# EAGLE design ai_esp12e_aerial (EAGLE 7.2.0)
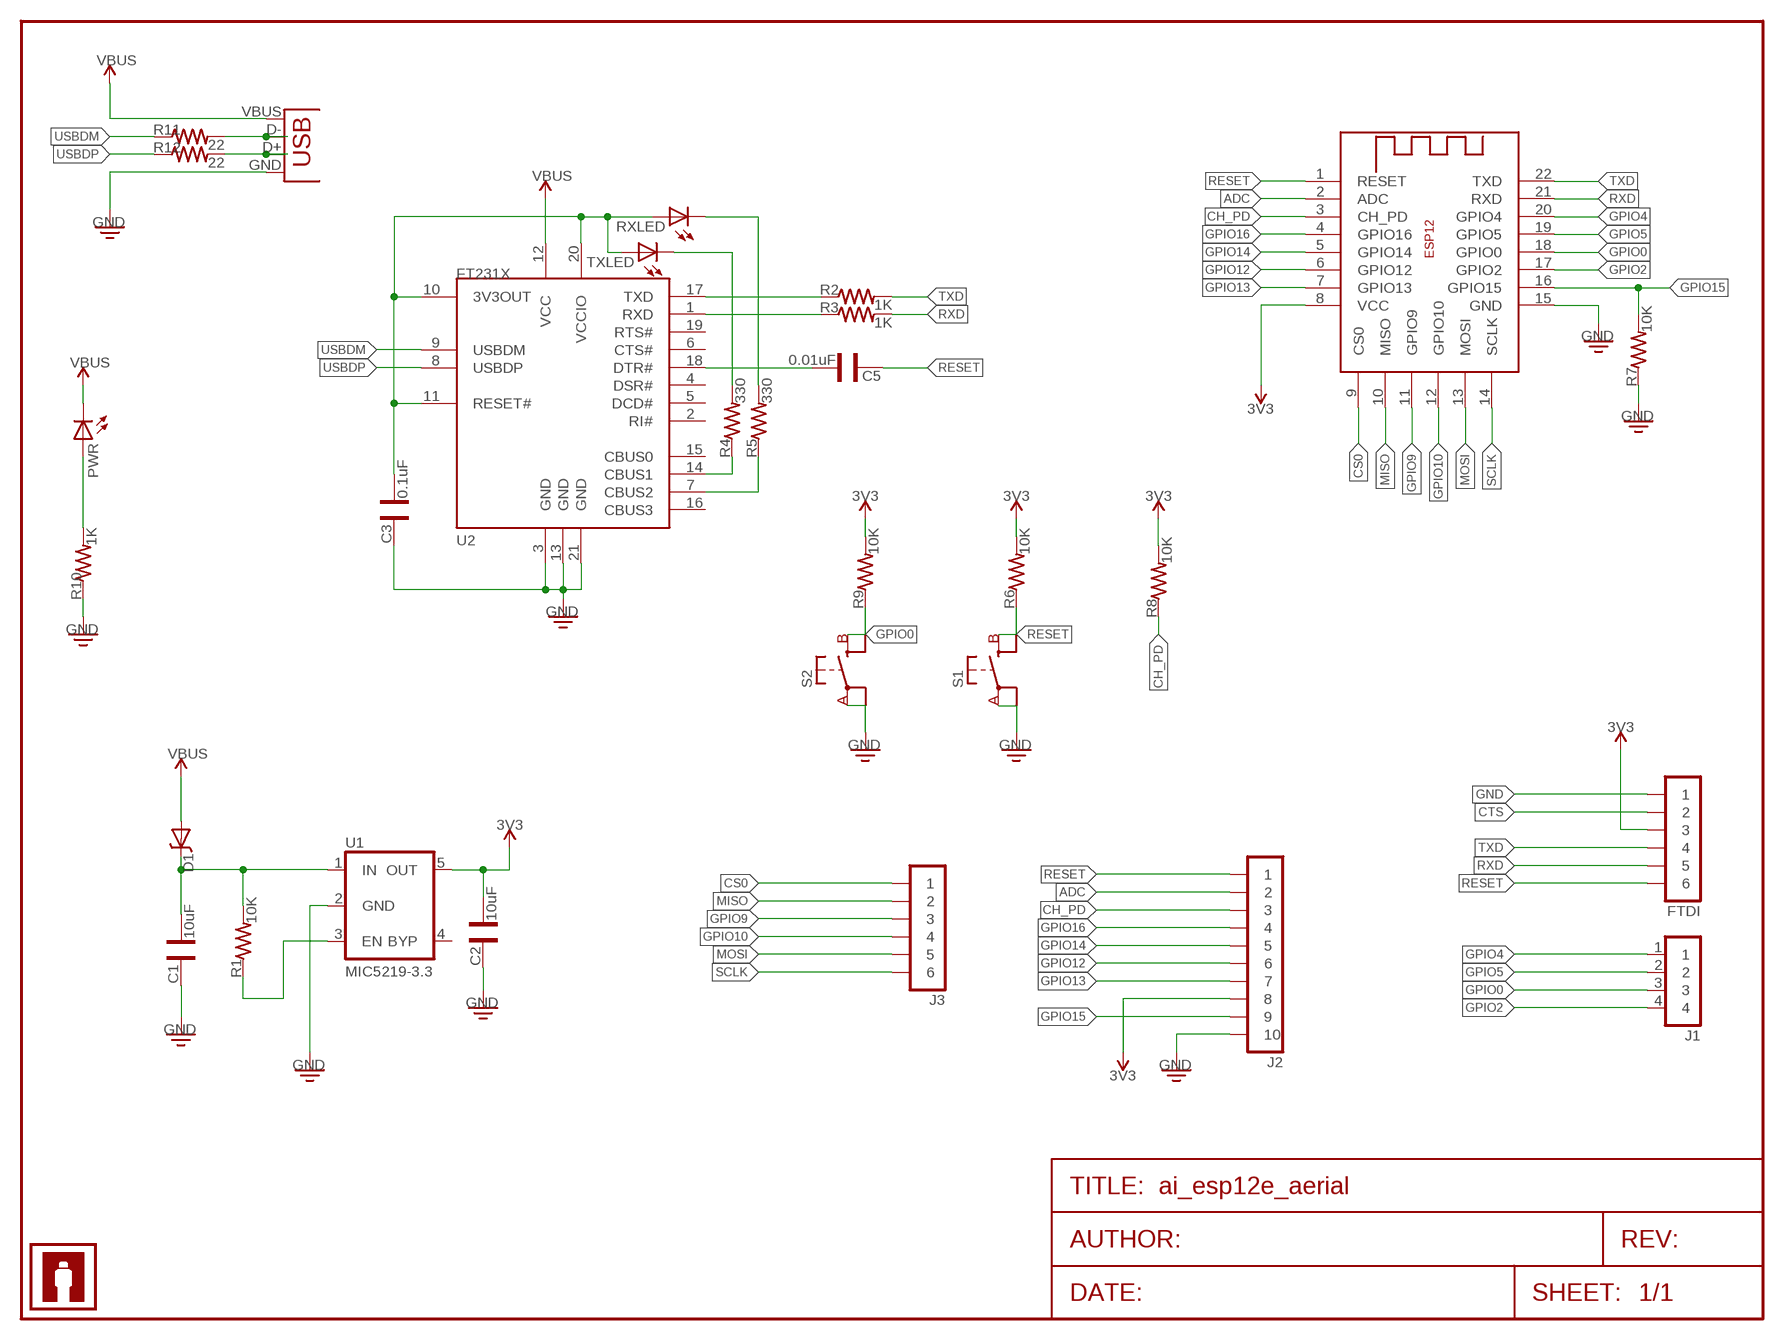
[diagram p0: schematic, sheet 1]
FRAME1 (FRAME-LETTER): AUTHOR: S. Parada

## Parts
C1  10uF  CAP0603  [CAP-0603]
C2  10uF  CAP0603  [CAP-0603]
C3  0.1uF  CAP0603  [CAP-0603]
C5  0.01uF  CAP0603  [CAP-0603]
D1  DIODE-SCHOTTKYSOD-523  [SOD-523]
FTDI  1X06FTDI  [1X06-CUSTOMSP]
J1  1X04NFNS  [1X04-NFNS]
J2  1X10NFNS  [1X10-NFNS]
J3  1X061X06-NFNS  [1X06-NFNS]
PWR  LED0603  [LED-0603]
R1  10K  RES0603  [RES-0603]
R2  1K  RES0603  [RES-0603]
R3  1K  RES0603  [RES-0603]
R4  330  RES0603  [RES-0603]
R5  330  RES0603  [RES-0603]
R6  10K  RES0603  [RES-0603]
R7  10K  RES0603  [RES-0603]
R8  10K  RES0603  [RES-0603]
R9  10K  RES0603  [RES-0603]
R10  1K  RES0603  [RES-0603]
R11  22  RES0603  [RES-0603]
R12  22  RES0603  [RES-0603]
RXLED  LED0603  [LED-0603]
S1  SW-SPSTSMD06X035  [SW-SPST-SMD06X-035]
S2  SW-SPSTSMD06X035  [SW-SPST-SMD06X-035]
TXLED  LED0603  [LED-0603]
U1  MIC5219-3.3  [SOT23-5]
U2  FT231X-Q  [QFN20]
U$1  AI-LOGOXS  [AI-LOGO-XS]
USB1  USBMICROB-TH  [USB-MICROB-TH]
X1  ESP-12  [ESP-12]

## Nets
3V3: C2.1 FTDI.3 J2.8 R6.2 R8.2 R9.2 U1.5(OUT) X1.8(VCC)
ADC: J2.2 X1.2(ADC)
CH_PD: J2.3 R8.1 X1.3(CH_PD)
CS0: J3.1 X1.9(CS0)
CTS: FTDI.2
GND: C1.2 C2.2 C3.2 FTDI.1 J2.10 R7.1 R10.1 S1.P$1(A) S2.P$1(A) U1.2(GND) U2.3(GND) U2.13(GND) U2.21(GND) USB1.GND X1.15(GND)
GPIO0: J1.3 R9.1 S2.P$2(B) X1.18(GPIO0)
GPIO2: J1.4 X1.17(GPIO2)
GPIO4: J1.1 X1.20(GPIO4)
GPIO5: J1.2 X1.19(GPIO5)
GPIO9: J3.3 X1.11(GPIO9)
GPIO10: J3.4 X1.12(GPIO10)
GPIO12: J2.6 X1.6(GPIO12)
GPIO13: J2.7 X1.7(GPIO13)
GPIO14: J2.5 X1.5(GPIO14)
GPIO15: J2.9 R7.2 X1.16(GPIO15)
GPIO16: J2.4 X1.4(GPIO16)
MISO: J3.2 X1.10(MISO)
MOSI: J3.5 X1.13(MOSI)
N$1: C1.1 D1.C R1.2 U1.1(IN)
N$3: R2.1 U2.17(TXD)
N$4: R1.1 U1.3(EN)
N$5: C3.1 RXLED.A TXLED.A U2.10(3V3OUT) U2.11(RESET#) U2.20(VCCIO)
N$6: R3.1 U2.1(RXD)
N$7: R4.2 TXLED.C
N$8: R5.1 U2.7(CBUS2)
N$9: R4.1 U2.14(CBUS1)
N$10: R5.2 RXLED.C
N$11: C5.1 U2.18(DTR#)
N$27: PWR.A R10.2
N$30: R11.2 USB1.D-
N$31: R12.2 USB1.D+
RESET: C5.2 FTDI.6 J2.1 R6.1 S1.P$2(B) X1.1(RESET)
RXD: FTDI.5 R3.2 X1.21(RXD)
SCLK: J3.6 X1.14(SCLK)
TXD: FTDI.4 R2.2 X1.22(TXD)
USBDM: R11.1 U2.9(USBDM)
USBDP: R12.1 U2.8(USBDP)
VBUS: D1.A PWR.C U2.12(VCC) USB1.VBUS
Unconnected: U1.4(BYP) U2.2(RI#) U2.4(DSR#) U2.5(DCD#) U2.6(CTS#) U2.15(CBUS0) U2.16(CBUS3) U2.19(RTS#)

## Library data of the parts
C1-C3 C5 = Ai_Passives:CAP
D1 = Ai_DiscreteSemis:DIODE-SCHOTTKY: Commonly MBRA140.
FTDI J3 = Ai_Connectors:1X06
J1 = Ai_Connectors:1X04
J2 = Ai_Connectors:1X10
PWR RXLED TXLED = Ai_LED:LED
R1-R12 = Ai_Passives:RES: Part # blah Digikey
S1 S2 = Ai_Electromechanical:SW-SPST
U1 = Ai_Power:MIC5219-*
U2 = Ai_IC:FT231X
U$1 = Ai_Miscellany:AI-LOGO
USB1 = Ai_Connectors:USB
X1 = Ai_IC:ESP-12

## Board
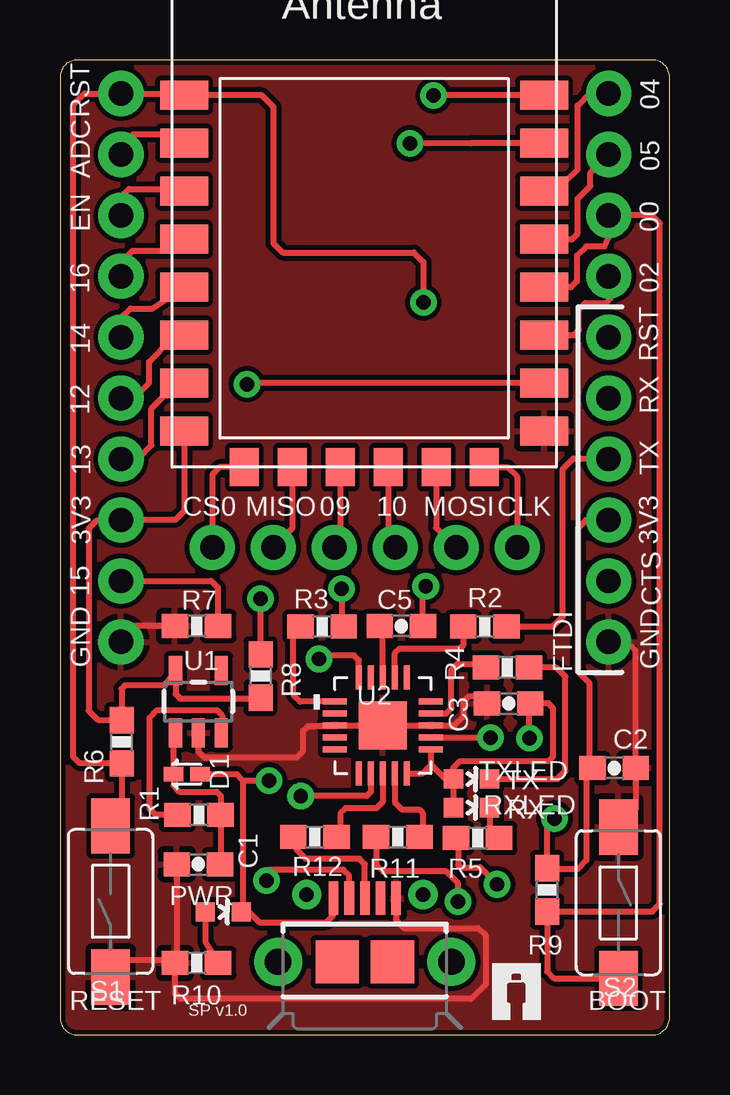
[diagram p1: board, top side]
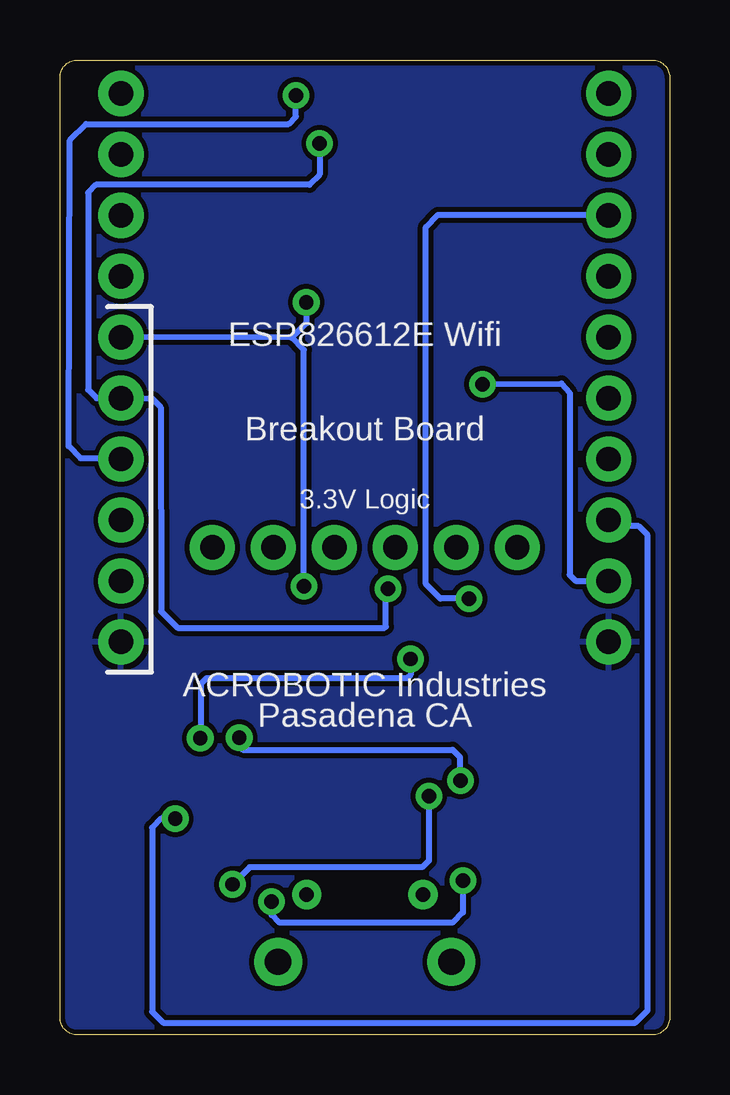
[diagram p2: board, bottom side, seen from below]

Size 25.4 x 40.64 mm. Coordinates in mm from the lower left corner, seen from the top.
Outline: 0,39.92 0,0.72 arc90 0.72,0 24.68,0 arc90 25.4,0.72 25.4,39.92 arc90 24.68,40.64 0.72,40.64 arc90 0,39.92
Copper layers (1*16): Top 0.035mm / dielectric 1.5mm / Bottom 0.035mm
Design rules "ai_2layer": minimum track width 7mil, minimum drill 15mil, track to track 8mil, track to pad 8mil, pad to pad 8mil, via to via 8mil, smd to smd 8mil, copper to edge 8mil, drill to drill 8mil, minimum pad ring 12mil, minimum via ring 10mil, stop-mask expansion 4mil, vias tented up to drill 20mil, thermal gap 10mil

### Footprints (pad centres in the part's own frame; a part is rotated, then mirrored left to right if it is on the bottom)
CAP-0603 = smd 1.1 x 1: 1 -0.9,0; 2 0.9,0
SOD-523 = smd 0.8 x 0.6: A -0.55,0; C 0.55,0
1X06-CUSTOMSP = drill 1.016 pad 1.88: 1 -6.35,0; 2 -3.81,0; 3 -1.27,0; 4 1.27,0; 5 3.81,0; 6 6.35,0
1X04-NFNS = drill 1.016 pad 1.88: 1 -3.81,0; 2 -1.27,0; 3 1.27,0; 4 3.81,0
1X10-NFNS = drill 1.016 pad 1.88: 1 -11.43,0; 2 -8.89,0; 3 -6.35,0; 4 -3.81,0; 5 -1.27,0; 6 1.27,0; 7 3.81,0; 8 6.35,0; 9 8.89,0; 10 11.43,0
1X06-NFNS = drill 1.016 pad 1.88: 1 -6.35,0; 2 -3.81,0; 3 -1.27,0; 4 1.27,0; 5 3.81,0; 6 6.35,0
LED-0603 = smd 0.8 x 0.8: A 0,-0.75; C 0,0.75
RES-0603 = smd 1.1 x 1: 1 -0.9,0; 2 0.9,0
SW-SPST-SMD06X-035 = smd 2.3 x 1.6: P$1 -3.15,0; P$2 3.15,0
SOT23-5 = smd 0.55 x 1.2: 1 -0.95,-1.3; 2 0,-1.3; 3 0.95,-1.3; 4 0.95,1.3; 5 -0.95,1.3
QFN20 = smd 1 x 0.25: 1 -2.032,0.968; 2 -2.032,0.468; 3 -2.032,-0.032; 4 -2.032,-0.532; 5 -2.032,-1.032; 11 1.968,-1.032; 12 1.968,-0.532; 13 1.968,-0.032; 14 1.968,0.468; 15 1.968,0.968 | smd 0.25 x 1: 6 -1.032,-2.032; 7 -0.532,-2.032; 8 -0.032,-2.032; 9 0.468,-2.032; 10 0.968,-2.032; 16 0.968,1.968; 17 0.468,1.968; 18 -0.032,1.968; 19 -0.532,1.968; 20 -1.032,1.968 | smd 2 x 2: 21 -0.032,-0.032
USB-MICROB-TH = smd 0.4 x 1.4: D+ 0,2.65; D- -0.65,2.65; GND 1.3,2.65; ID 0.65,2.65; VBUS -1.3,2.65 | smd 1.8 x 1.8: M5 -1.15,0; M6 1.15,0 | drill 0.6 pad 1.2: MT1 -2.425,2.8; MT2 2.425,2.8 | drill 1.1 pad 2: MT3 -3.61,0; MT4 3.61,0
ESP-12 = smd 2 x 1.2: 1 -7.5,4.5; 2 -7.5,2.5; 3 -7.5,0.5; 4 -7.5,-1.5; 5 -7.5,-3.5; 6 -7.5,-5.5; 7 -7.5,-7.5; 8 -7.5,-9.5; 15 7.5,-9.5; 16 7.5,-7.5; 17 7.5,-5.5; 18 7.5,-3.5; 19 7.5,-1.5; 20 7.5,0.5; 21 7.5,2.5; 22 7.5,4.5 | smd 1.2 x 1.6: 9 -5,-11; 10 -3,-11; 11 -1,-11; 12 1,-11; 13 3,-11; 14 5,-11

### Placement (x,y rotation side)
C1  5.77,7.11 180 top
C2  23.09,11.13 0 top
C3  18.69,13.82 180 top
C5  14.22,17.04 0 top
D1  5.28,10.87 180 top
FTDI  22.86,22.73 90 top
J1  22.86,35.43 270 top
J2  2.54,27.81 270 top
J3  12.7,20.32 0 top
PWR  6.81,5.13 270 top
R1  5.79,9.17 0 top
R2  17.7,17.02 0 top
R3  10.92,17.02 0 top
R4  18.64,15.32 0 top
R5  17.4,8.2 0 top
R6  2.57,12.22 90 top
R7  5.69,17.04 0 top
R8  8.36,14.96 270 top
R9  20.29,6.05 90 top
R10  5.69,3 0 top
R11  14.07,8.26 180 top
R12  10.62,8.26 180 top
RXLED  17.14,9.47 270 top
S1  2.11,5.56 90 top
S2  23.27,5.51 270 top
TXLED  17.14,10.67 270 top
U1  5.77,13.89 0 top
U2  13.49,12.93 0 top
U$1  18.03,0.64 0 top
USB1  12.7,3.05 0 top
X1  12.67,34.67 0 top

### Tracks (layer width: path | path; a pad name or v marks a point on that pad's centre or on a via)
3V3  (via drill 0.6)
  Top 0.254: FTDI.3 21.92,21.46 21.59,21.13 21.59,15.14 22.06,14.67 22.06,11.25 C2.1 21.95,11.09 21.95,7.29 21.57,6.91 20.33,6.91 R9.2 20.3,8.71 v20.6,9.02 | R8.2 8.24,14.02 5,14.02 4.82,14.21 U1.5 4.38,14.58 2.72,14.58 2.56,14.43 R6.2 2.55,13.13 1.57,13.13 1.19,13.51 1.19,21.11 1.52,21.44 J2.8 4.8,21.46 5.17,21.84 X1.8
  Bottom 0.254: v20.6,9.02 21.18,9.02 21.57,8.64 21.57,0.96 21.11,0.51 1.42,0.51 0.91,1.02 0.91,20.83 1.29,21.21 2.29,21.21 J2.8
ADC
  Top 0.254: J2.2 2.54,37.03 3.05,37.54 5.19,37.54 X1.2
CH_PD  (via drill 0.6)
  Top 0.254: J2.3 2.54,34.92 2.87,35.26 4.9,35.26 X1.3 | R8.1 v8.36,18.19
  Bottom 0.254: v8.36,18.19 9.55,18.19 10.16,18.8 10.16,33.68 9.65,34.19 2.56,34.19 J2.3
CS0
  Top 0.254: X1.9 6.65,23.67 6.35,23.37 J3.1
GND
  Top 0.254: U2.21 U2.3 11.44,12.88 10.34,12.88 10.13,12.68 10.13,11.84 9.86,11.56 6.02,11.56 5.77,11.81 U1.2 | U2.21 U2.13 16.43,12.9 16.82,13.28 16.82,13.89 17.04,14.12 17.72,14.12 C3.2 | C1.2 4.87,3.07 R10.1 | S1.P$1 2.11,2.59 2.64,3.12 4.66,3.12 R10.1 | U2.21 13.46,12.82 13.34,12.7 | 23.29,8.69 S2.P$1 23.99,9.38 C2.2 23.99,16.02 23.62,16.38 FTDI.1 | R7.1 3,17.04 2.82,16.87 2.82,16.66 J2.10 | USB1.GND 14,4.8 14.35,4.45 17.42,4.45 17.73,4.14 17.73,2.11 17.12,1.5 5.03,1.5 4.8,1.73 4.8,2.99 R10.1
  pour Top: 24.68,0 0.72,0 arc-90 0,0.72 0,39.92 arc-90 0.72,40.64 24.68,40.64 arc-90 25.4,39.92 25.4,0.72 arc-90
  pour Bottom: 0,39.92 0,0.72 arc90 0.72,0 24.68,0 arc90 25.4,0.72 25.4,39.92 arc90 24.68,40.64 0.72,40.64 arc90
GPIO0
  Top 0.254: X1.18 21.29,31.17 21.54,31.42 21.54,32.49 21.92,32.87 22.68,32.87 22.86,33.27 J1.3 24.66,34.16 24.99,33.83 24.99,5.46 24.68,5.14 R9.1 20.3,2.64 20.57,2.36 S2.P$2 | S2.P$2
GPIO2
  Top 0.254: X1.17 21.4,29.17 21.61,29.39 21.61,30.23 21.89,30.5 22.73,30.5 22.94,30.71 22.94,31.55 J1.4
GPIO4
  Top 0.254: X1.20 21,35.5 21.57,36.07 21.57,38.73 22.1,39.27 22.84,39.27 J1.1
GPIO5
  Top 0.254: X1.19 21.34,33.17 21.57,33.4 21.57,34.85 22.1,35.38 22.1,35.94 J1.2
GPIO9
  Top 0.254: X1.11 11.68,20.57 J3.3
GPIO10
  Top 0.254: X1.12 13.68,20.57 J3.4
GPIO12
  Top 0.254: J2.6 3.07,26.54 3.71,27.18 3.71,28.07 4.6,28.96 4.96,28.96 X1.6
GPIO13
  Top 0.254: J2.7 3.25,24.03 3.81,24.59 3.81,26.11 4.32,26.62 5.11,26.75 5.51,26.9 5.18,27.16 X1.7
GPIO14
  Top 0.254: J2.5 2.54,29.87 2.95,30.28 3.85,30.28 X1.5
GPIO15  (via drill 0.6)
  Top 0.254: J2.9 6.3,18.92 6.58,18.64 6.58,17.05 R7.2 | X1.16 7.84,27.17 v7.8,27.13
  Bottom 0.254: v7.8,27.13 4.5,27.15 4.17,26.77 4.17,19.18 3.91,18.92 J2.9
GPIO16
  Top 0.254: J2.4 2.54,32.18 3.02,32.69 4.34,32.69 X1.4
MISO
  Top 0.254: X1.10 9.68,21.11 J3.2
MOSI
  Top 0.254: X1.13 15.68,21.13 J3.5
N$1
  Top 0.254: U1.1 4.73,12.33 D1.C 4.73,10.38 4.98,10.13 6.53,10.13 6.71,9.96 6.71,9.18 R1.2 6.69,7.14 C1.1
N$3
  Top 0.254: U2.17 13.96,15.91 14.15,16.1 16.66,16.1 16.82,16.26 16.82,17.01 R2.1
N$4
  Top 0.254: R1.1 3.99,9.17 3.73,9.42 3.73,13.23 4.04,13.54 6.53,13.54 6.76,13.31 6.76,12.48 U1.3
N$5  (via drill 0.6)
  Top 0.254: U2.10 15.11,10.9 15.47,11.25 | 15.47,11.25 15.47,11.88 U2.11 15.49,11.86 | TXLED.A RXLED.A | 15.47,11.25 16.03,10.69 16.67,10.69 TXLED.A | TXLED.A 16.38,10.88 16.38,11.12 16.66,11.4 20.34,11.4 20.55,11.61 20.55,13.61 20.34,13.82 C3.1 19.56,13.78 v19.56,12.37 | U2.20 12.46,15.61 12.24,15.82 10.95,15.82 v10.79,15.67
  Bottom 0.254: v10.79,15.67 10.79,15.01 10.95,14.86 19.3,14.86 19.53,14.63 19.53,12.34 v19.56,12.37
N$6
  Top 0.254: U2.1 10.01,13.9 9.73,14.17 9.73,16.88 R3.1
N$7
  Top 0.254: TXLED.C 20.73,10.67 21.06,11 21.06,14.94 20.68,15.32 R4.2
N$8  (via drill 0.6)
  Top 0.254: U2.7 12.96,10.14 12.78,9.96 v10.03,9.96 | R5.1 16.59,8.04 16.59,7.09 16.69,6.99 17.5,6.99 v18.21,6.27
  Bottom 0.254: v10.03,9.96 10.03,7.26 10.31,6.99 17.5,6.99 v18.21,6.27
N$9
  Top 0.254: U2.14 16.09,13.4 16.31,13.61 16.31,15.21 16.56,15.47 17.9,15.47 R4.1
N$10
  Top 0.254: RXLED.C 17.92,8.28 R5.2
N$11
  Top 0.254: U2.18 13.46,16.91 C5.1
N$27
  Top 0.254: PWR.A 6.06,3.86 R10.2
N$30  (via drill 0.6)
  Top 0.254: USB1.D- 12.05,6.64 11.81,6.88 8.69,6.88 8.64,6.83 8.64,6.45 v8.61,6.43 | v16.59,5.56 16.59,6.33 16.1,6.81 13.46,6.81 13.21,7.06 13.21,8.32 R11.2
  Bottom 0.254: v8.61,6.43 8.61,5.11 9.04,4.67 16.26,4.67 16.59,5 v16.59,5.56
N$31
  Top 0.254: USB1.D+ 12.7,7.11 12.47,7.34 10.24,7.34 9.86,7.72 9.86,8.19 R12.2
RESET  (via drill 0.6)
  Top 0.254: S1.P$2 2.56,9.17 R6.1 0.82,11.32 0.56,11.58 0.56,38.79 1.02,39.24 J2.1 5.1,39.24 X1.1 8.41,39.17 8.89,38.68 8.89,32.99 9.27,32.61 14.75,32.61 15.14,32.22 v15.14,30.53 | C5.2 15.12,18.66 v15.24,18.69
  Bottom 0.254: v15.24,18.69 15.24,28.55 15.75,29.06 | 15.75,29.06 FTDI.6 | v15.14,30.53 15.14,29.67 15.75,29.06
RXD  (via drill 0.6)
  Top 0.254: X1.21 17.11,37.17 v14.58,37.16 | v11.73,18.59 11.73,17.11 R3.2
  Bottom 0.254: 22.89,26.77 FTDI.5 | FTDI.5 23.88,26.54 24.23,26.9 24.23,35.1 23.9,35.43 15.01,35.43 14.58,35.87 v14.58,37.16 | v11.73,18.59 11.82,18.33 R3.2 11.87,16.97 20.5,16.97 21.18,17.65 21.21,26.16 21.57,26.52 22.94,26.54 FTDI.5
SCLK
  Top 0.254: X1.14 18.64,23.67 19.05,23.27 J3.6
TXD  (via drill 0.6)
  Top 0.254: R2.2 20.52,17.02 20.95,17.45 20.95,23.6 21.39,24.03 22.84,24.03 FTDI.4 | X1.22 v15.57,39.17
  Bottom 0.254: FTDI.4 22.84,24.03 24.54,24.03 25.04,24.54 24.99,37.29 24.31,37.97 15.88,37.97 15.57,38.28 v15.57,39.17
USBDM
  Top 0.254: U2.9 13.96,9.69 14.25,9.4 14.96,9.4 15.11,9.25 15.11,8.24 R11.1
USBDP
  Top 0.254: U2.8 13.46,9.72 13.18,9.45 11.89,9.45 11.68,9.25 11.68,8.24 R12.1
VBUS  (via drill 0.6)
  Top 0.254: USB1.VBUS 11.38,5.68 11.38,4.98 11.1,4.7 8.31,4.7 7.87,5.13 PWR.C 7.62,5.19 7.62,10.62 | D1.A 7.37,10.87 7.62,10.62 | U2.12 v17.93,12.4 v17.93,12.39 | v8.71,10.59 7.64,10.59 7.62,10.62
  Bottom 0.254: v17.93,12.39 17.93,12.04 17.78,11.89 9.04,11.89 8.74,11.58 8.74,10.62 v8.71,10.59

### Text on the board
tPlace: 04 | RST | ADC | 05 | EN | 00 | 16 | 02 | 14 | RST | 12 | RX | 13 | TX | CS0 | MISO | 09 | 10 | MOSI | CLK | 3V3 | 3V3 | 15 | CTS | GND | GND | TX | RX | RESET | SP v1.0 | BOOT
bPlace: ESP826612E Wifi | Breakout Board | 3.3V Logic | ACROBOTIC Industries | Pasadena CA